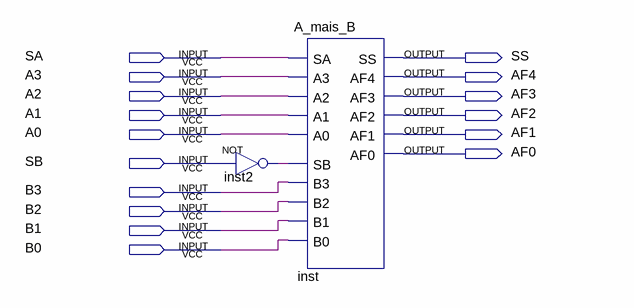
[diagram p0: schematic sheet]
// Quartus schematic A_menos_B.bdf as structural Verilog: 2 symbols, 16 pins
module A_menos_B (
  input  SA,
  input  A3,
  input  A2,
  input  A1,
  input  A0,
  input  SB,
  input  B3,
  input  B2,
  input  B1,
  input  B0,
  output SS,
  output AF4,
  output AF3,
  output AF2,
  output AF1,
  output AF0
);

  wire inst2_out;

  not inst2 (inst2_out, SB);
  A_mais_B inst (
    .SA(SA), .SB(inst2_out), .B3(B3), .B2(B2), .B1(B1), .B0(B0), .A3(A3), .A2(A2), .A1(A1), .A0(A0),
    .AF0(AF0), .AF1(AF1), .AF2(AF2), .AF3(AF3), .AF4(AF4), .SS(SS));
endmodule
